# EAGLE design L298 Motor Driver (EAGLE 6.4)
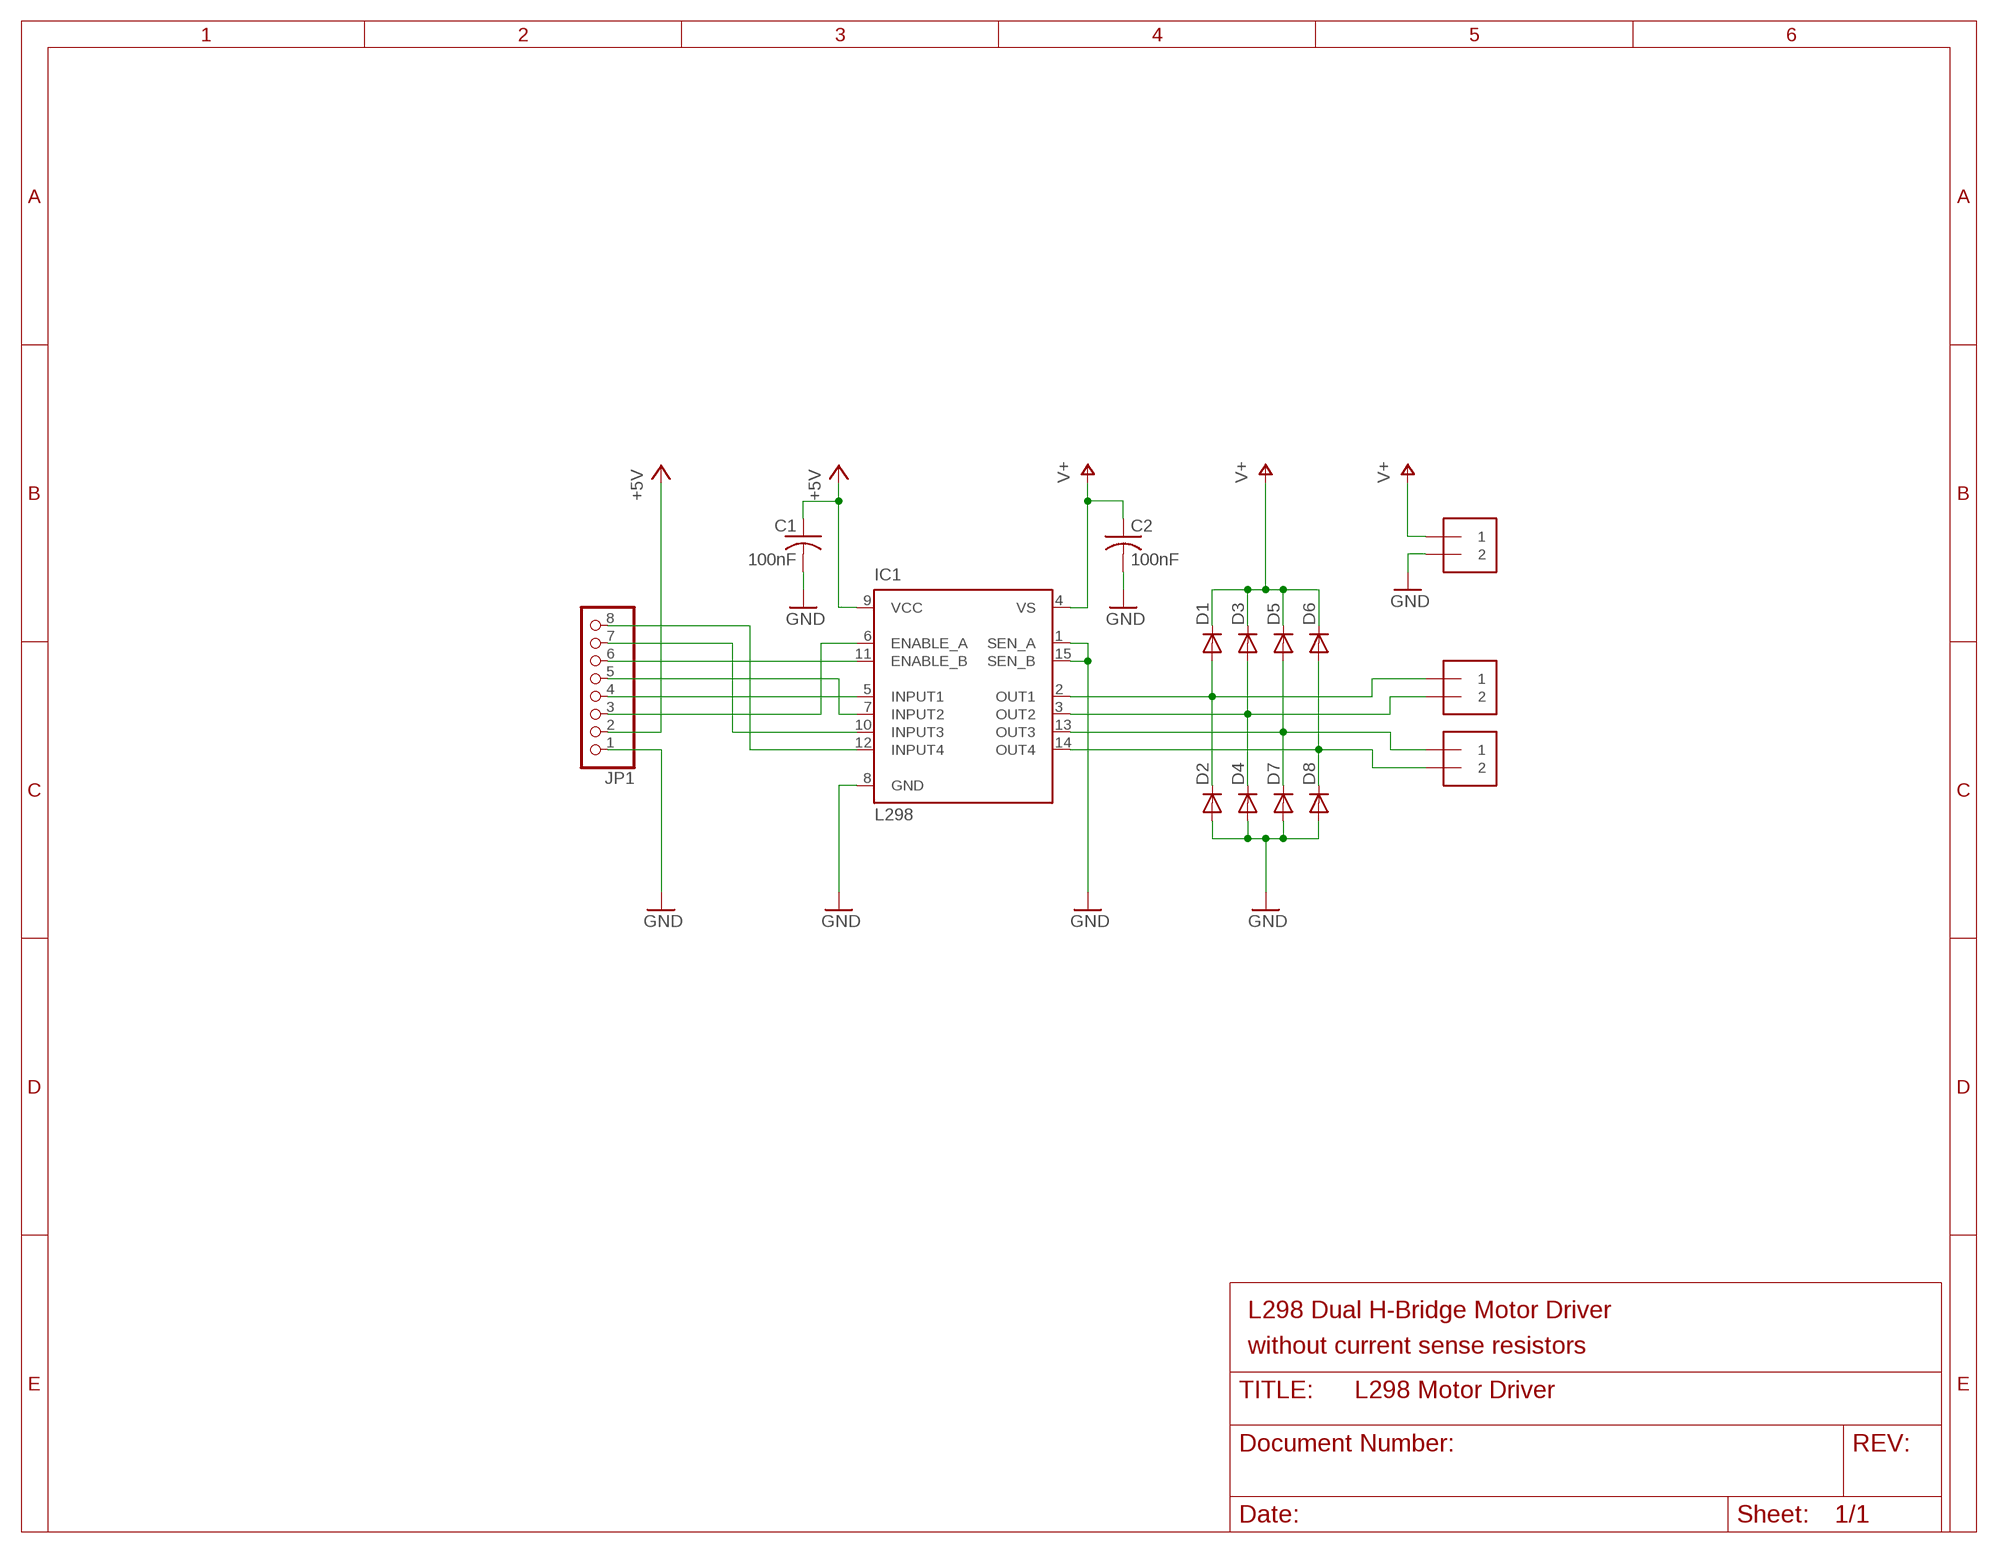
[diagram p0: schematic, sheet 1]

## Parts
C1  100nF  C-US050-024X044  [C050-024X044]
C2  100nF  C-US050-024X044  [C050-024X044]
D1  DIODE-D-5  [D-5]
D2  DIODE-D-5  [D-5]
D3  DIODE-D-5  [D-5]
D4  DIODE-D-5  [D-5]
D5  DIODE-D-5  [D-5]
D6  DIODE-D-5  [D-5]
D7  DIODE-D-5  [D-5]
D8  DIODE-D-5  [D-5]
IC1  L298  [MULTIWATT-15]
J1  1X2-3.5MM  [1X2-3.5MM]
J2  1X2-3.5MM  [1X2-3.5MM]
J3  1X2-3.5MM  [1X2-3.5MM]
JP1  PINHD-1X8  [1X08]

## Nets
+5V: C1.1 IC1.9(VCC) JP1.2
GND: C1.2 C2.2 D2.A D4.A D7.A D8.A IC1.1(SEN_A) IC1.8(GND) IC1.15(SEN_B) J1.2 JP1.1
N$1: D1.A D2.C IC1.2(OUT1) J2.1
N$2: D3.A D4.C IC1.3(OUT2) J2.2
N$3: D6.A D8.C IC1.14(OUT4) J3.2
N$4: D5.A D7.C IC1.13(OUT3) J3.1
N$5: IC1.5(INPUT1) JP1.4
N$6: IC1.7(INPUT2) JP1.5
N$7: IC1.6(ENABLE_A) JP1.3
N$8: IC1.11(ENABLE_B) JP1.6
N$9: IC1.10(INPUT3) JP1.7
N$10: IC1.12(INPUT4) JP1.8
V+: C2.1 D1.C D3.C D5.C D6.C IC1.4(VS) J1.1

## Notes on the sheet
- L298 Dual H-Bridge Motor Driver
- without current sense resistors

## Library data of the parts
C1 C2 = rcl:C-US: CAPACITOR, American symbol
D1-D8 = diode:DIODE-: DIODE
IC1 = st-microelectronics:L298: DUAL FULL-BRIDGE DRIVER; MPN: L298N; OC_FARNELL: 1589425; OC_NEWARK: 32M1527
J1-J3 = adafruit:1X2: 3.5mm Terminal block http://www.ladyada.net/library/pcb/eaglelibrary.html
JP1 = pinhead:PINHD-1X8: PIN HEADER

## Board
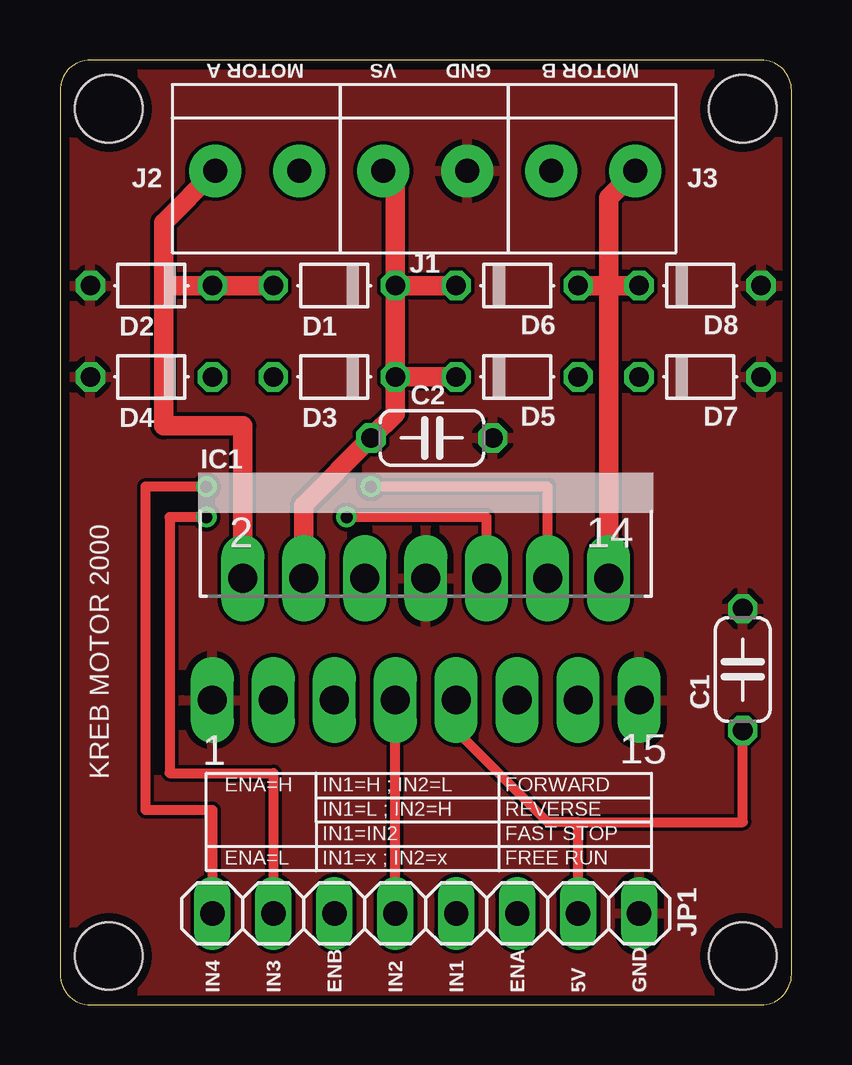
[diagram p1: board, top side]
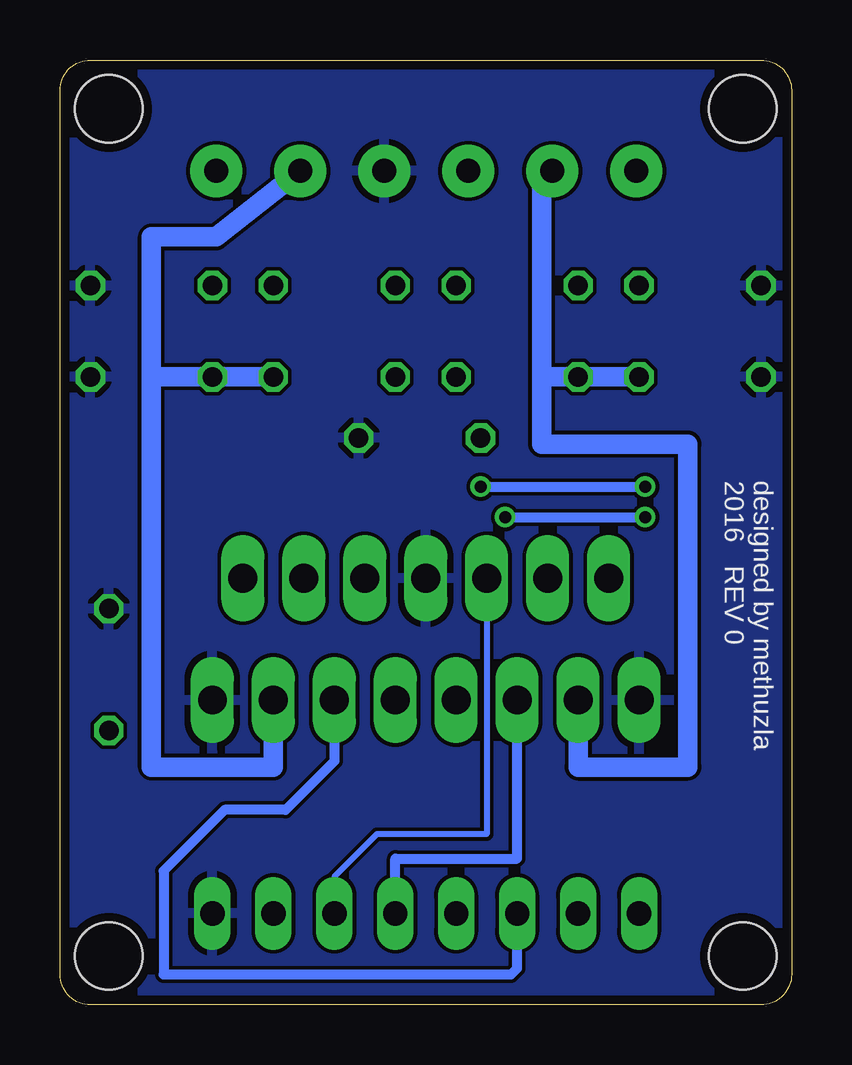
[diagram p2: board, bottom side, seen from below]

Size 30.48 x 39.37 mm. Coordinates in mm from the lower left corner, seen from the top.
Outline: 30.48,1.27 30.48,38.1 arc90 29.21,39.37 1.27,39.37 arc90 0,38.1 0,1.27 arc90 1.27,0 29.21,0 arc90 30.48,1.27
Copper layers (1*16): Top 0.0356mm / dielectric 1.5011mm / Bottom 0.0356mm
Design rules "LaenPCBOrder": minimum track width 6mil, minimum drill 13mil, track to track 6mil, track to pad 6mil, pad to pad 6mil, via to via 6mil, smd to smd 6mil, copper to edge 15mil, drill to drill 6mil, minimum pad ring 7mil, minimum via ring 7mil, stop-mask expansion 4mil, vias tented up to drill 0mil, thermal gap 10mil
Holes 2.8 mm at 2.03,2.03 28.45,2.03 28.45,37.34 2.03,37.34

### Footprints (pad centres in the part's own frame; a part is rotated, then mirrored left to right if it is on the bottom)
C050-024X044 = drill 0.813 octagon: 1 -2.54,0; 2 2.54,0
D-5 = drill 0.813 octagon: A 2.54,0; C -2.54,0
MULTIWATT-15 = drill 1.2 long: 1 -8.89,-7.62; 2 -7.62,-2.54; 3 -6.35,-7.62; 4 -5.08,-2.54; 5 -3.81,-7.62; 6 -2.54,-2.54; 7 -1.27,-7.62; 8 0,-2.54; 9 1.27,-7.62; 10 2.54,-2.54; 11 3.81,-7.62; 12 5.08,-2.54; 13 6.35,-7.62; 14 7.62,-2.54; 15 8.89,-7.62
1X2-3.5MM = drill 1 pad 2.184: 1 1.8,0; 2 -1.7,0
1X08 = drill 1.016 long: 1 -8.89,0; 2 -6.35,0; 3 -3.81,0; 4 -1.27,0; 5 1.27,0; 6 3.81,0; 7 6.35,0; 8 8.89,0

### Placement (x,y rotation side)
C1  28.45,13.97 90 top
C2  15.49,23.62 0 top
D1  11.43,29.97 180 top
D2  3.81,29.97 180 top
D3  11.43,26.16 180 top
D4  3.81,26.16 180 top
D5  19.05,26.16 0 top
D6  19.05,29.97 0 top
D7  26.67,26.16 0 top
D8  26.67,29.97 0 top
IC1  15.24,20.32 0 top
J1  15.27,34.75 180 top
J2  8.27,34.75 180 top
J3  22.27,34.75 180 top
JP1  15.24,3.81 180 top

### Tracks (layer width: path | path; a pad name or v marks a point on that pad's centre or on a via)
+5V
  Top 0.406: IC1.9 16.51,11.43 20.32,7.62 21.59,7.62 | JP1.2 21.59,7.62 | 21.59,7.62 28.45,7.62 C1.1
GND
  pour Top: 0,0 0,39.37 30.48,39.37 30.48,0
  pour Bottom: 0,0 0,39.37 30.48,39.37 30.48,0
N$1
  Top 0.813: 4.32,29.97 4.32,32.59 J2.1 | D1.A D2.C 4.32,29.97 | IC1.2 7.62,24.13 4.32,24.13 4.32,29.97
N$2
  Bottom 0.813: IC1.3 8.89,9.91 4.32,9.91 4.32,23.37 10.41,23.37 10.41,26.16 | 10.41,26.16 10.41,34.3 J2.2 | D4.C D3.A 10.41,26.16
N$3
  Top 0.813: IC1.14 22.86,29.97 | 22.86,29.97 22.86,33.64 J3.2 | D6.A 22.86,29.97 | D8.C 22.86,29.97
N$4
  Bottom 0.813: IC1.13 21.59,9.91 26.67,9.91 26.67,25.91 | 26.67,25.91 26.67,32 23.97,32 J3.1 | D5.A D7.C 26.42,26.16 26.67,25.91
N$5
  Bottom 0.406: JP1.4 16.51,6.1 11.43,6.1 IC1.5
N$6
  Top 0.406: JP1.5 IC1.7
N$7
  Bottom 0.254: IC1.6 12.7,7.11 17.27,7.11 19.05,5.33 JP1.3
N$8
  Bottom 0.406: IC1.11 19.05,10.16 21.08,8.13 23.62,8.13 26.16,5.59 26.16,1.27 11.68,1.27 11.43,1.52 JP1.6
N$9  (via drill 0.5)
  Top 0.406: IC1.10 17.78,20.32 v11.94,20.32 | v6.1,20.32 4.57,20.32 4.57,9.65 8.89,9.65 JP1.7
  Bottom 0.406: v11.94,20.32 v6.1,20.32
N$10  (via drill 0.5)
  Top 0.406: IC1.12 20.32,21.59 v12.95,21.59 | v6.1,21.59 3.56,21.59 3.56,8.13 6.35,8.13 JP1.8
  Bottom 0.406: v12.95,21.59 v6.1,21.59
V+
  Top 0.813: IC1.4 10.16,20.83 C2.1 13.97,24.64 D3.C | D3.C D1.C | D1.C 13.97,34.75 J1.1 | D1.C D6.C | D3.C D5.C

### Text on the board
tPlace: MOTOR A | VS | GND | MOTOR B | KREB MOTOR 2000 | ENA=H | IN1=H ; IN2=L | FORWARD | IN1=L ; IN2=H | REVERSE | IN1=IN2 | FAST STOP | ENA=L | IN1=x ; IN2=x | FREE RUN | IN4 | IN3 | ENB | IN2 | IN1 | ENA | 5V | GND
bPlace: designed by methuzla / 2016 REV 0